# Altium schematic sheet Kello_Nixie.SchDoc
size A4; ApprovedBy: Krzysztof Belewicz; CheckedBy: Krzysztof Belewicz; Author: Krzysztof Belewicz; DrawnBy: Krzysztof Belewicz; Engineer: Krzysztof Belewicz; Revision: 1.0; SheetNumber: 2; SheetTotal: 4
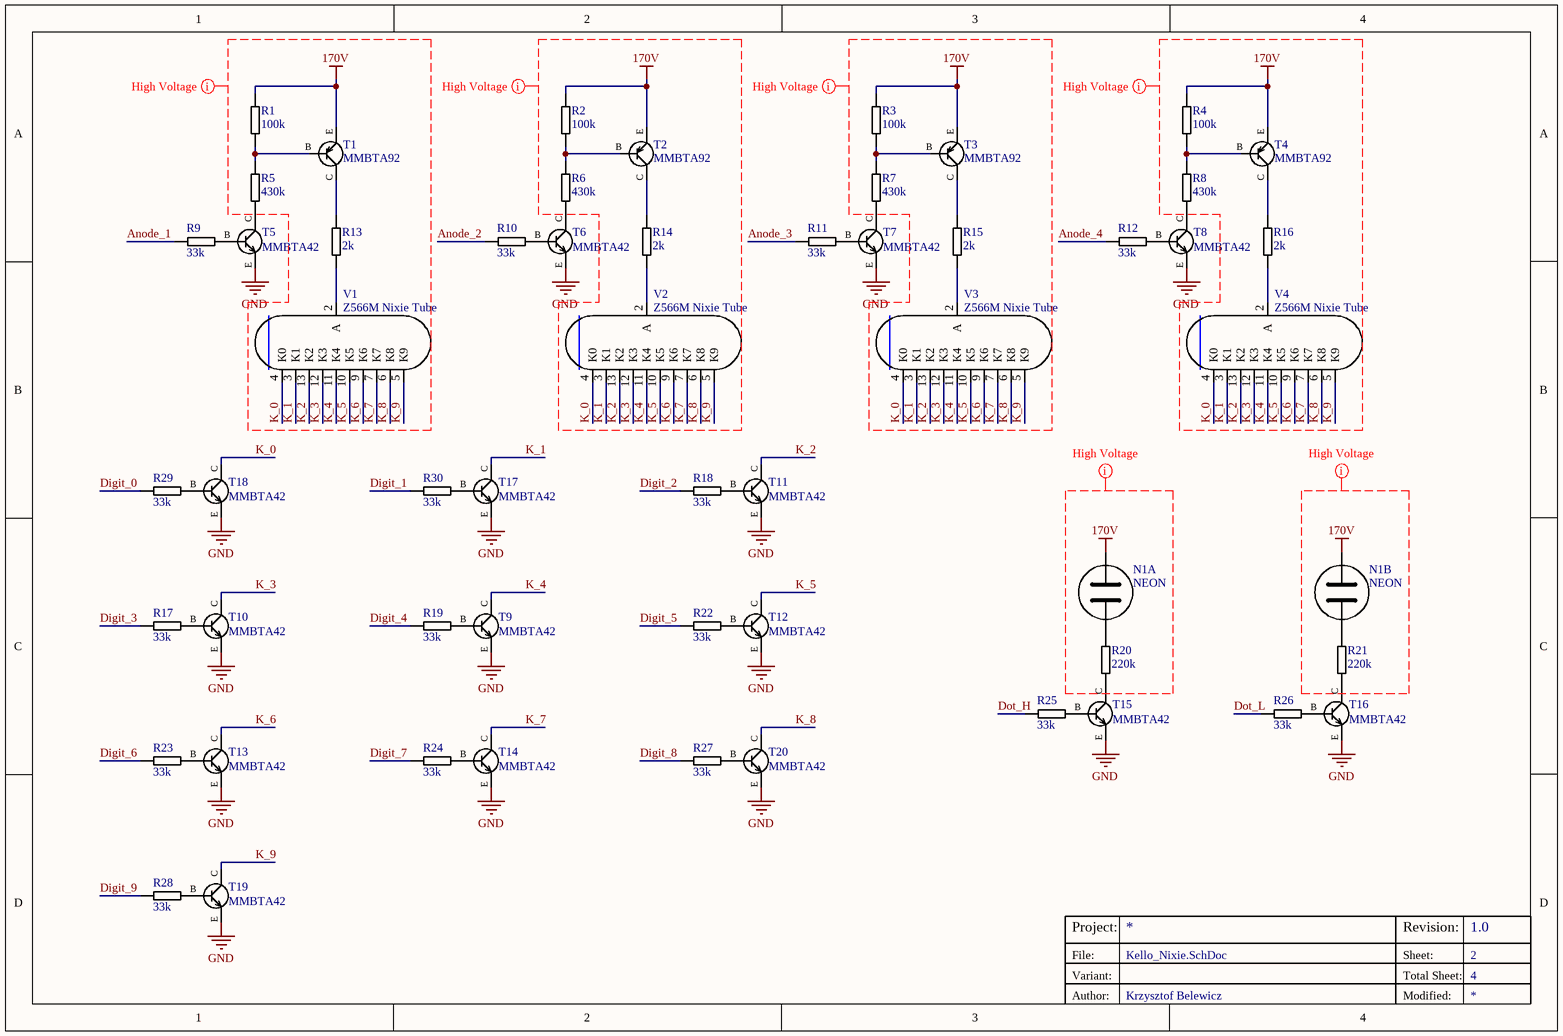
[diagram p0: Kello_Nixie.SchDoc]

## Parts
N1  NEON  [NEON-9]  (parts A,B of 2)
R1  value 100k  [RESC1608N]  (hidden comment: Resistor)
R2  value 100k  [RESC1608N]  (hidden comment: Resistor)
R3  value 100k  [RESC1608N]  (hidden comment: Resistor)
R4  value 100k  [RESC1608N]  (hidden comment: Resistor)
R5  value 430k  [RESC1608N]  (hidden comment: Resistor)
R6  value 430k  [RESC1608N]  (hidden comment: Resistor)
R7  value 430k  [RESC1608N]  (hidden comment: Resistor)
R8  value 430k  [RESC1608N]  (hidden comment: Resistor)
R9  value 33k  [RESC1608N]  (hidden comment: Resistor)
R10  value 33k  [RESC1608N]  (hidden comment: Resistor)
R11  value 33k  [RESC1608N]  (hidden comment: Resistor)
R12  value 33k  [RESC1608N]  (hidden comment: Resistor)
R13  value 2k  [RESC1608N]  (hidden comment: Resistor)
R14  value 2k  [RESC1608N]  (hidden comment: Resistor)
R15  value 2k  [RESC1608N]  (hidden comment: Resistor)
R16  value 2k  [RESC1608N]  (hidden comment: Resistor)
R17  value 33k  [RESC1608N]  (hidden comment: Resistor)
R18  value 33k  [RESC1608N]  (hidden comment: Resistor)
R19  value 33k  [RESC1608N]  (hidden comment: Resistor)
R20  value 220k  [RESC1608N]  (hidden comment: Resistor)
R21  value 220k  [RESC1608N]  (hidden comment: Resistor)
R22  value 33k  [RESC1608N]  (hidden comment: Resistor)
R23  value 33k  [RESC1608N]  (hidden comment: Resistor)
R24  value 33k  [RESC1608N]  (hidden comment: Resistor)
R25  value 33k  [RESC1608N]  (hidden comment: Resistor)
R26  value 33k  [RESC1608N]  (hidden comment: Resistor)
R27  value 33k  [RESC1608N]  (hidden comment: Resistor)
R28  value 33k  [RESC1608N]  (hidden comment: Resistor)
R29  value 33k  [RESC1608N]  (hidden comment: Resistor)
R30  value 33k  [RESC1608N]  (hidden comment: Resistor)
T1  MMBTA92  [SOT23-3N]
T2  MMBTA92  [SOT23-3N]
T3  MMBTA92  [SOT23-3N]
T4  MMBTA92  [SOT23-3N]
T5  MMBTA42  [SOT23-3N]
T6  MMBTA42  [SOT23-3N]
T7  MMBTA42  [SOT23-3N]
T8  MMBTA42  [SOT23-3N]
T9  MMBTA42  [SOT23-3N]
T10  MMBTA42  [SOT23-3N]
T11  MMBTA42  [SOT23-3N]
T12  MMBTA42  [SOT23-3N]
T13  MMBTA42  [SOT23-3N]
T14  MMBTA42  [SOT23-3N]
T15  MMBTA42  [SOT23-3N]
T16  MMBTA42  [SOT23-3N]
T17  MMBTA42  [SOT23-3N]
T18  MMBTA42  [SOT23-3N]
T19  MMBTA42  [SOT23-3N]
T20  MMBTA42  [SOT23-3N]
V1  Z566M Nixie Tube  [Z566M]
V2  Z566M Nixie Tube  [Z566M]
V3  Z566M Nixie Tube  [Z566M]
V4  Z566M Nixie Tube  [Z566M]

## Nets
170V: N1.2 R1.1 R2.1 R3.1 R4.1 T1.E T2.E T3.E T4.E
GND: T5.E T6.E T7.E T8.E T9.E T10.E T11.E T12.E T13.E T14.E T15.E T16.E T17.E T18.E T19.E T20.E
Anode_1: R9.1
Anode_2: R10.1
Anode_3: R11.1
Anode_4: R12.1
Digit_0: R29.1
Digit_1: R30.1
Digit_2: R18.1
Digit_3: R17.1
Digit_4: R19.1
Digit_5: R22.1
Digit_6: R23.1
Digit_7: R24.1
Digit_8: R27.1
Digit_9: R28.1
Dot_H: R25.1
Dot_L: R26.1
K_0: T18.C V1.4(K0) V2.4(K0) V3.4(K0) V4.4(K0)
K_1: T17.C V1.3(K1) V2.3(K1) V3.3(K1) V4.3(K1)
K_2: T11.C V1.13(K2) V2.13(K2) V3.13(K2) V4.13(K2)
K_3: T10.C V1.12(K3) V2.12(K3) V3.12(K3) V4.12(K3)
K_4: T9.C V1.11(K4) V2.11(K4) V3.11(K4) V4.11(K4)
K_5: T12.C V1.10(K5) V2.10(K5) V3.10(K5) V4.10(K5)
K_6: T13.C V1.9(K6) V2.9(K6) V3.9(K6) V4.9(K6)
K_7: T14.C V1.7(K7) V2.7(K7) V3.7(K7) V4.7(K7)
K_8: T20.C V1.6(K8) V2.6(K8) V3.6(K8) V4.6(K8)
K_9: T19.C V1.5(K9) V2.5(K9) V3.5(K9) V4.5(K9)
NetN1_1: N1.1 R20.1
NetN1_3: N1.3 R21.1
NetR1_2: R1.2 R5.1 T1.B
NetR2_2: R2.2 R6.1 T2.B
NetR3_2: R3.2 R7.1 T3.B
NetR4_2: R4.2 R8.1 T4.B
NetR5_2: R5.2 T5.C
NetR6_2: R6.2 T6.C
NetR7_2: R7.2 T7.C
NetR8_2: R8.2 T8.C
NetR9_2: R9.2 T5.B
NetR10_2: R10.2 T6.B
NetR11_2: R11.2 T7.B
NetR12_2: R12.2 T8.B
NetR13_1: R13.1 T1.C
NetR13_2: R13.2 V1.2(A)
NetR14_1: R14.1 T2.C
NetR14_2: R14.2 V2.2(A)
NetR15_1: R15.1 T3.C
NetR15_2: R15.2 V3.2(A)
NetR16_1: R16.1 T4.C
NetR16_2: R16.2 V4.2(A)
NetR17_2: R17.2 T10.B
NetR18_2: R18.2 T11.B
NetR19_2: R19.2 T9.B
NetR20_2: R20.2 T15.C
NetR21_2: R21.2 T16.C
NetR22_2: R22.2 T12.B
NetR23_2: R23.2 T13.B
NetR24_2: R24.2 T14.B
NetR25_2: R25.2 T15.B
NetR26_2: R26.2 T16.B
NetR27_2: R27.2 T20.B
NetR28_2: R28.2 T19.B
NetR29_2: R29.2 T18.B
NetR30_2: R30.2 T17.B

## Layout directives
rule Clearance Constraint [Clearance = 19.685mil]; net class HIGH VOLTAGE: 170V, K_0, K_1, K_2, K_3, K_4, K_5, K_6, K_7, K_8, K_9

## Notes on the sheet
- Project:
- Variant:
- File:
- Sheet:
- Revision:
- Total Sheet:
- Author:
- Modified:

## Library data of the parts
N1 = NEON-9: Neon Tube; Supplier 1: TME; Supplier Part Number 1: NEON-9
R1-R4 = Resistor: Manufacturer 1: VISHAY; Manufacturer Part Number 1: CRCW0603100KFKEA; Tolerance: 1%; Power: 0.1W; Supplier 1: TME; Supplier Part Number 1: CRCW0603100KFKEA
R5-R12 R17-R30 = Resistor: Tolerance: 1%; Power: *; Supplier 1: TME; Supplier 2: *
  R5-R8: Supplier Part Number 1: SMD0603-430k
  R9-R12 R17-R19 R22-R30: Supplier Part Number 1: SMD0603-33k
  R20 R21: Supplier Part Number 1: SMD0603-220k
R13-R16 = Resistor: Manufacturer 1: ROYAL OHM; Manufacturer Part Number 1: 0603SAF2001T5E; Tolerance: 1%; Power: 0.1W; Supplier 1: TME; Supplier Part Number 1: SMD0603-2K-1%
T1-T4 = 2N5087: PNP Transistor; pin to pad: B>1 C>3 E>2; Supplier 1: TME; Supplier Part Number 1: MMBTA92
T5-T20 = 2N3707: NPN Transistor; pin to pad: B>1 C>3 E>2; Supplier 1: TME; Supplier Part Number 1: MMBTA42LT1G
V1-V4 = Z566M